# Altium schematic sheet [03] TOP.SchDoc: Top schematic
size A4; Engineer: M. Folejewski; DocumentNumber: 3; SheetNumber: 3; SheetTotal: 15; PageSize: A4; Designators: 1-99
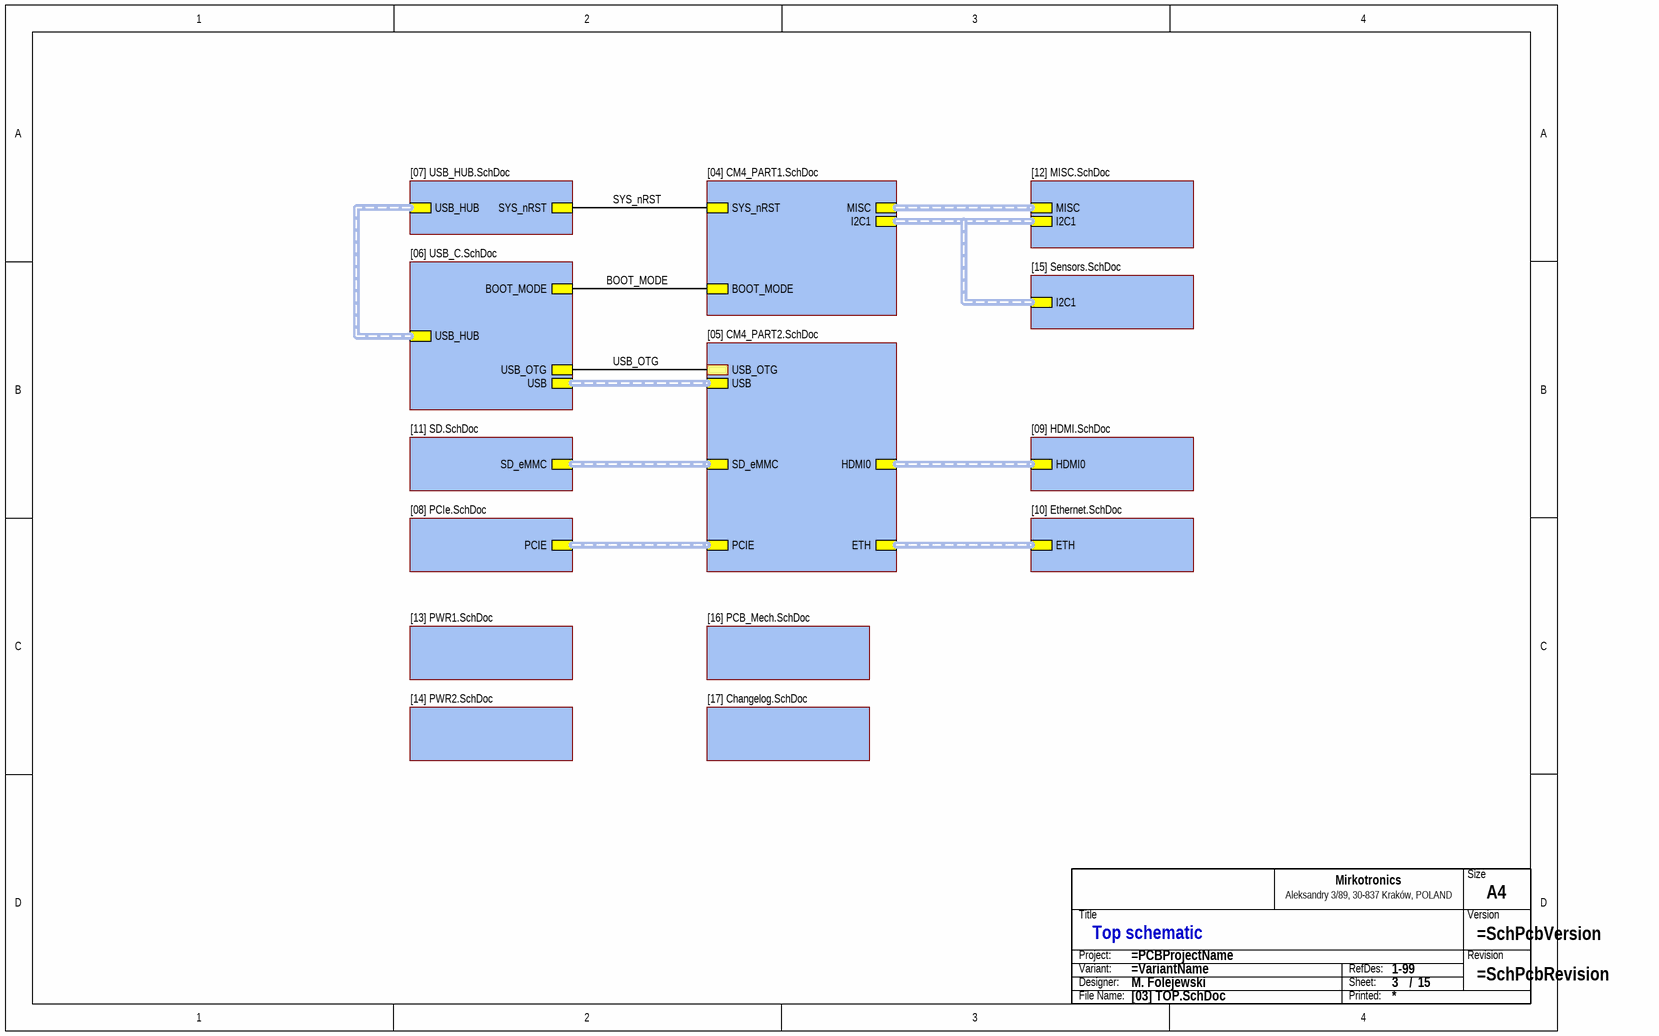
[diagram p0: [03] TOP.SchDoc]

## Parts
TB?  Title block  (value not drawn)  (graphical)

## Sub-sheets
BLK1 = [04] CM4_PART1.SchDoc: BOOT_MODE, MISC (harness MISC), SYS_nRST, I2C1 (harness I2C1)
BLK2 = [05] CM4_PART2.SchDoc: USB (harness USB), PCIE (harness PCIE), SD_eMMC (harness SD_eMMC), USB_OTG, ETH (harness ETH), HDMI0 (harness HDMI)
BLK4 = [08] PCIe.SchDoc: PCIE (harness PCIE)
BLK4 = [10] Ethernet.SchDoc: ETH (harness ETH)
BLK4 = [11] SD.SchDoc: SD_eMMC (harness SD_eMMC)
BLK4 = [16] PCB_Mech.SchDoc: no entries
BLK4 = [15] Sensors.SchDoc: I2C1 (harness I2C1)
BLK4 = [17] Changelog.SchDoc: no entries
BLK4 = [12] MISC.SchDoc: MISC (harness MISC), I2C1 (harness I2C1)
BLK4 = [09] HDMI.SchDoc: HDMI0 (harness HDMI)
BLK4 = [07] USB_HUB.SchDoc: USB_HUB (harness USB_HUB), SYS_nRST
BLK4 = [13] PWR1.SchDoc: no entries
BLK5 = [06] USB_C.SchDoc: USB (harness USB), BOOT_MODE, USB_OTG, USB_HUB (harness USB_HUB)
BLK5 = [14] PWR2.SchDoc: no entries

## Nets
BOOT_MODE: sheet BLK1/BOOT_MODE, sheet BLK5/BOOT_MODE
SYS_nRST: sheet BLK1/SYS_nRST, sheet BLK4/SYS_nRST
USB_OTG: sheet BLK2/USB_OTG, sheet BLK5/USB_OTG

## Buses and harness runs
harness sheet BLK1/I2C1 = sheet BLK4/I2C1
harness sheet BLK1/MISC = sheet BLK4/MISC
harness sheet BLK2/ETH = sheet BLK4/ETH
harness sheet BLK2/HDMI0 = sheet BLK4/HDMI0
harness sheet BLK2/PCIE = sheet BLK4/PCIE
harness sheet BLK2/SD_eMMC = sheet BLK4/SD_eMMC
harness sheet BLK2/USB = sheet BLK5/USB
harness sheet BLK4/USB_HUB = sheet BLK5/USB_HUB

## Notes on the sheet
- (in symbol SCH_TITLE_BLOCK_MIRKOTRONICS_V2) Size; Mirkotronics; Aleksandry 3/89, 30-837 Kraków, POLAND; Title; Version; Project:; Revision; Variant:; RefDes:; Designer:; Sheet:; /; File Name:; Printed:

## Library data of the parts
TB? = SCH_TITLE_BLOCK_MIRKOTRONICS_V2: Component Type: Title block; Manufacturer: -; Mounting Type: Non component; MPN: -; Operating Temperature: -; Package: -; Specification: Title block; Value: Title block; Replacement: -; System: ?